# Altium project 280049 Tester Board.PrjPcb
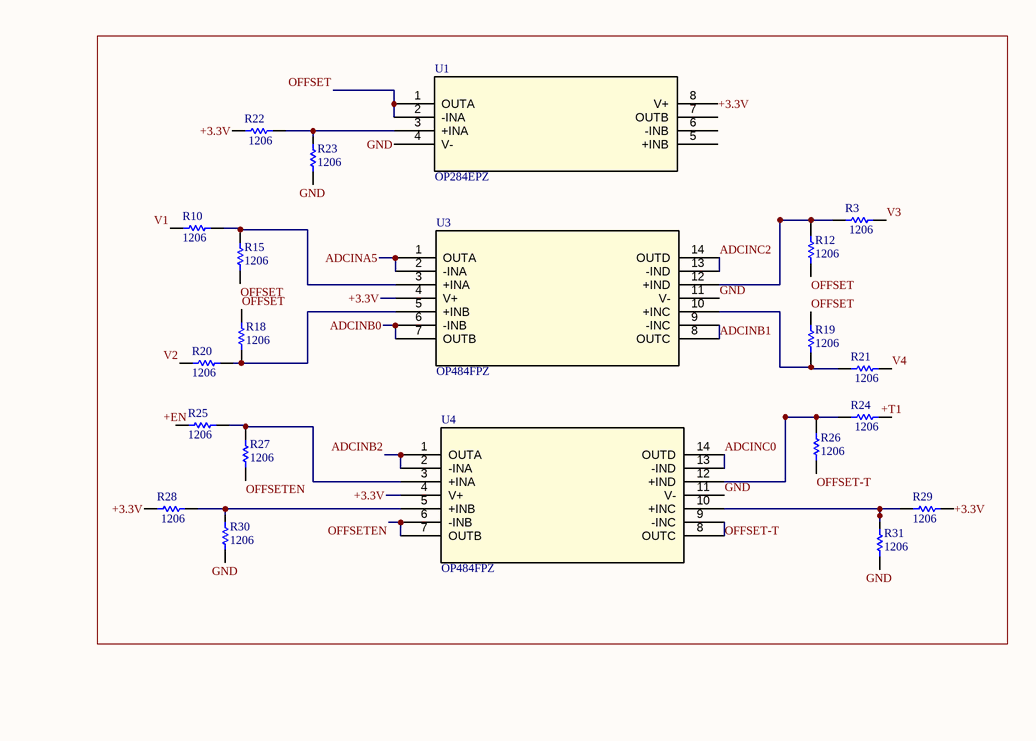
[diagram p0: 280049 tester board.SchDoc, top left]
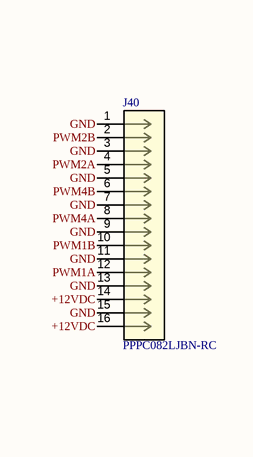
[diagram p1: 280049 tester board.SchDoc, top right]
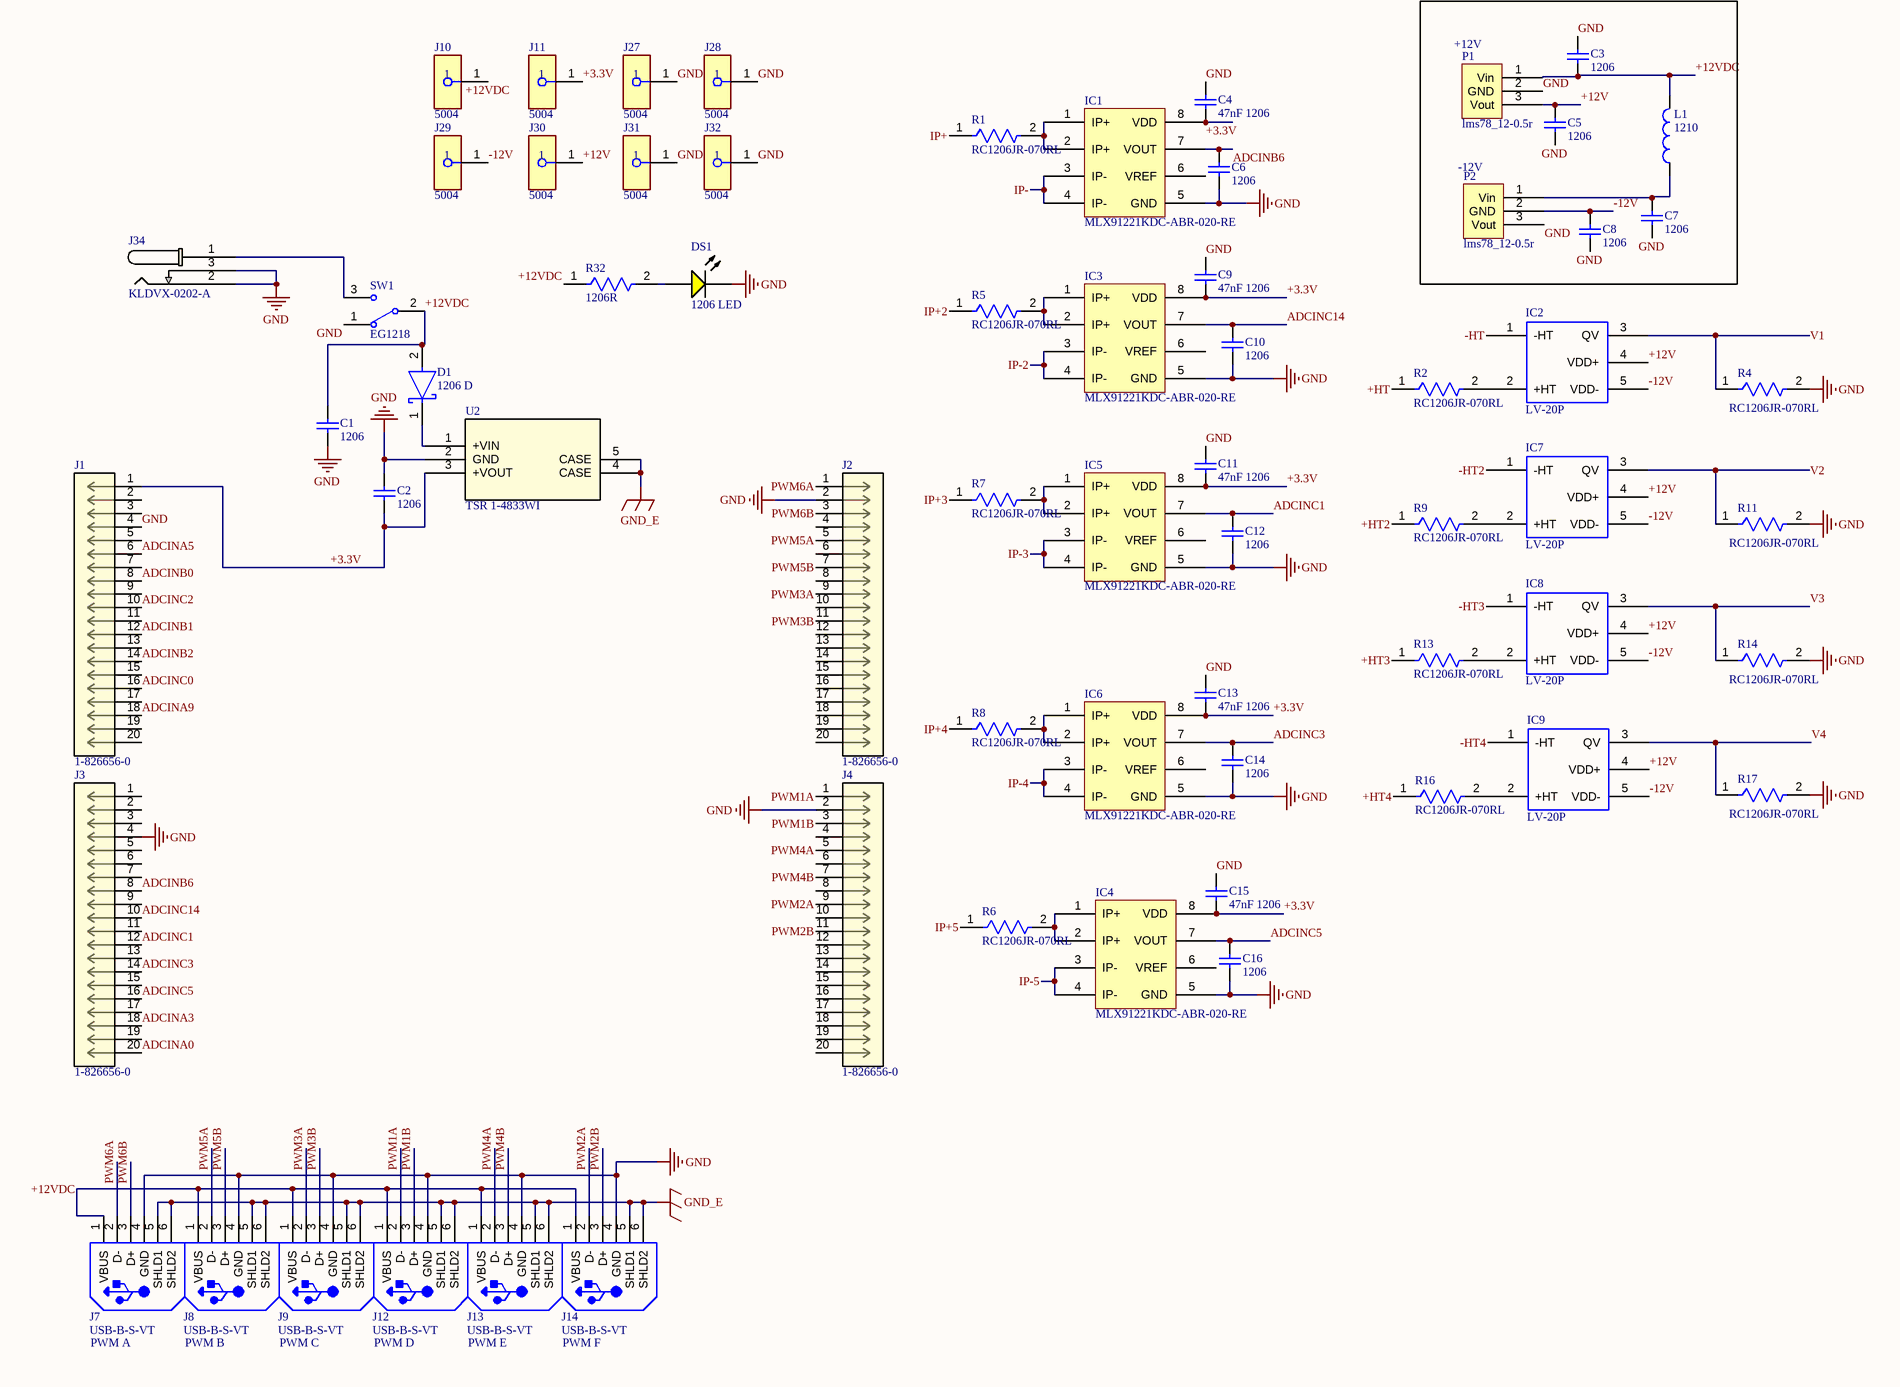
[diagram p2: 280049 tester board.SchDoc, bottom left]
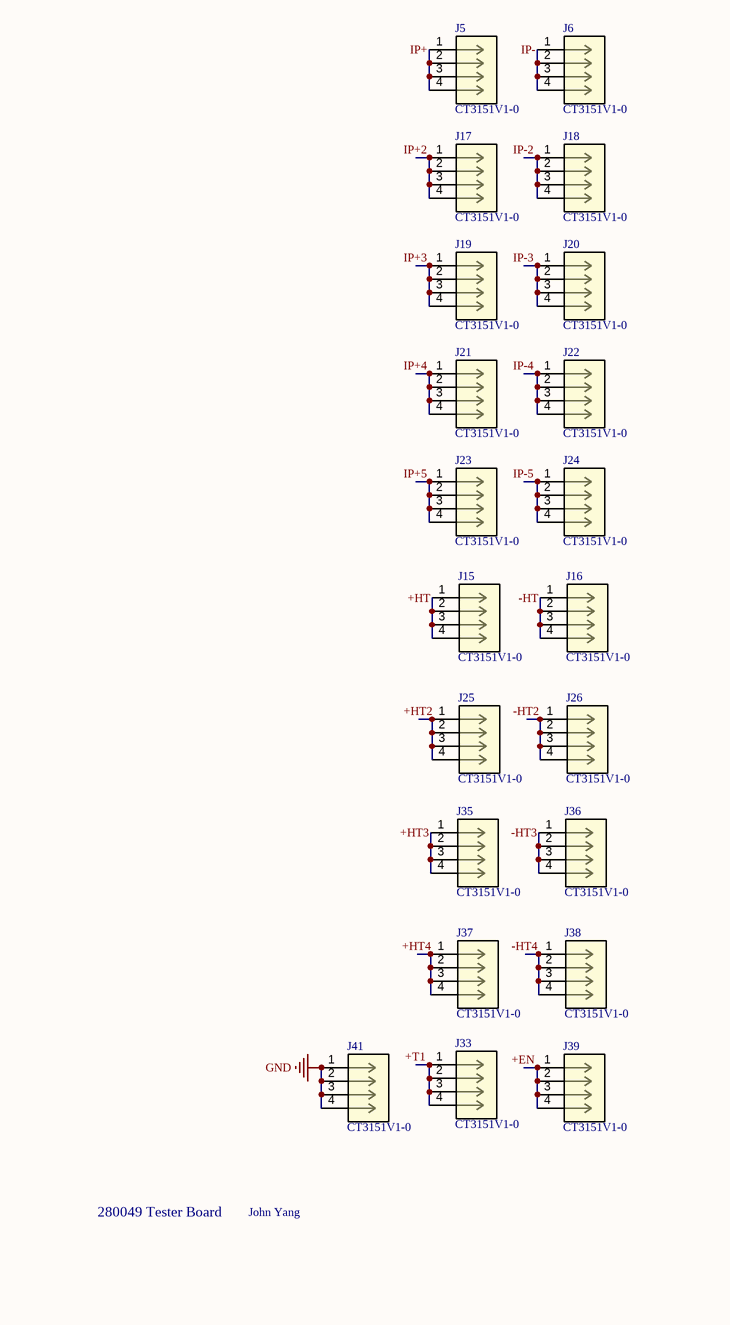
[diagram p3: 280049 tester board.SchDoc, bottom right]
1 sheet, 108 parts. Net scope: global (net labels, ports and power ports of the same name join across sheets).
Board file: 280049 tester board.PcbDoc

## Sheet 280049 tester board.SchDoc
size 558 x 431 mm; SheetNumber: 1; SheetTotal: 1

### Parts
C1  1206  [CAPC1206(3216)130_M]
C2  1206  [CAPC1206(3216)130_M]
C3  1206  [CAPC1206(3216)130_M]
C4  47nF 1206  [CAPC1206(3216)130_M]
C5  1206  [CAPC1206(3216)130_M]
C6  1206  [CAPC1206(3216)130_M]
C7  1206  [CAPC1206(3216)130_M]
C8  1206  [CAPC1206(3216)130_M]
C9  47nF 1206  [CAPC1206(3216)130_M]
C10  1206  [CAPC1206(3216)130_M]
C11  47nF 1206  [CAPC1206(3216)130_M]
C12  1206  [CAPC1206(3216)130_M]
C13  47nF 1206  [CAPC1206(3216)130_M]
C14  1206  [CAPC1206(3216)130_M]
C15  47nF 1206  [CAPC1206(3216)130_M]
C16  1206  [CAPC1206(3216)130_M]
D1  1206 D  [FP-SD1206S-MFG]
DS1  1206 LED  [LUMX-SML-LX1206YC-TR_V]
IC1  MLX91221KDC-ABR-020-RE  [MLX91221KDC-ABR-020-RE]
IC2  LV-20P  [LV-20P]
IC3  MLX91221KDC-ABR-020-RE  [MLX91221KDC-ABR-020-RE]
IC4  MLX91221KDC-ABR-020-RE  [MLX91221KDC-ABR-020-RE]
IC5  MLX91221KDC-ABR-020-RE  [MLX91221KDC-ABR-020-RE]
IC6  MLX91221KDC-ABR-020-RE  [MLX91221KDC-ABR-020-RE]
IC7  LV-20P  [LV-20P]
IC8  LV-20P  [LV-20P]
IC9  LV-20P  [LV-20P]
J1  1-826656-0  [CON20_2X10_P100UM_HDR_TYC]
J2  1-826656-0  [CON20_2X10_P100UM_HDR_TYC]
J3  1-826656-0  [CON20_2X10_P100UM_HDR_TYC]
J4  1-826656-0  [CON20_2X10_P100UM_HDR_TYC]
J5  CT3151V1-0  [CON4_CT3151V1-0_CTE]
J6  CT3151V1-0  [CON4_CT3151V1-0_CTE]
J7  PWM A  Supplier Part Number 1: USB-B-S-VT  [CONN4_5787834-1_TEC]
J8  PWM B  Supplier Part Number 1: USB-B-S-VT  [CONN4_5787834-1_TEC]
J9  PWM C  Supplier Part Number 1: USB-B-S-VT  [CONN4_5787834-1_TEC]
J10  5004  [FP-5004-MFG]
J11  5004  [FP-5004-MFG]
J12  PWM D  Supplier Part Number 1: USB-B-S-VT  [CONN4_5787834-1_TEC]
J13  PWM E  Supplier Part Number 1: USB-B-S-VT  [CONN4_5787834-1_TEC]
J14  PWM F  Supplier Part Number 1: USB-B-S-VT  [CONN4_5787834-1_TEC]
J15  CT3151V1-0  [CON4_CT3151V1-0_CTE]
J16  CT3151V1-0  [CON4_CT3151V1-0_CTE]
J17  CT3151V1-0  [CON4_CT3151V1-0_CTE]
J18  CT3151V1-0  [CON4_CT3151V1-0_CTE]
J19  CT3151V1-0  [CON4_CT3151V1-0_CTE]
J20  CT3151V1-0  [CON4_CT3151V1-0_CTE]
J21  CT3151V1-0  [CON4_CT3151V1-0_CTE]
J22  CT3151V1-0  [CON4_CT3151V1-0_CTE]
J23  CT3151V1-0  [CON4_CT3151V1-0_CTE]
J24  CT3151V1-0  [CON4_CT3151V1-0_CTE]
J25  CT3151V1-0  [CON4_CT3151V1-0_CTE]
J26  CT3151V1-0  [CON4_CT3151V1-0_CTE]
J27  5004  [FP-5004-MFG]
J28  5004  [FP-5004-MFG]
J29  5004  [FP-5004-MFG]
J30  5004  [FP-5004-MFG]
J31  5004  [FP-5004-MFG]
J32  5004  [FP-5004-MFG]
J33  CT3151V1-0  [CON4_CT3151V1-0_CTE]
J34  KLDVX-0202-A  [JACK_KLDVX-0202_KYC]
J35  CT3151V1-0  [CON4_CT3151V1-0_CTE]
J36  CT3151V1-0  [CON4_CT3151V1-0_CTE]
J37  CT3151V1-0  [CON4_CT3151V1-0_CTE]
J38  CT3151V1-0  [CON4_CT3151V1-0_CTE]
J39  CT3151V1-0  [CON4_CT3151V1-0_CTE]
J40  PPPC082LJBN-RC  [CONN_PPPC082LJBN-RC_SUL]
J41  CT3151V1-0  [CON4_CT3151V1-0_CTE]
L1  1210  [TDK-NLV32-PF_V]
P1  lms78_12-0.5r  [lms78_12-0.5r]
P2  lms78_12-0.5r  [lms78_12-0.5r]
R1  RC1206JR-070RL  [FP-RC1206-MFG]
R2  RC1206JR-070RL  [FP-RC1206-MFG]
R3  1206  [RESC3216X70X50NL05T20]
R4  RC1206JR-070RL  [FP-RC1206-MFG]
R5  RC1206JR-070RL  [FP-RC1206-MFG]
R6  RC1206JR-070RL  [FP-RC1206-MFG]
R7  RC1206JR-070RL  [FP-RC1206-MFG]
R8  RC1206JR-070RL  [FP-RC1206-MFG]
R9  RC1206JR-070RL  [FP-RC1206-MFG]
R10  1206  [RESC3216X70X50NL05T20]
R11  RC1206JR-070RL  [FP-RC1206-MFG]
R12  1206  [RESC3216X70X50NL05T20]
R13  RC1206JR-070RL  [FP-RC1206-MFG]
R14  RC1206JR-070RL  [FP-RC1206-MFG]
R15  1206  [RESC3216X70X50NL05T20]
R16  RC1206JR-070RL  [FP-RC1206-MFG]
R17  RC1206JR-070RL  [FP-RC1206-MFG]
R18  1206  [RESC3216X70X50NL05T20]
R19  1206  [RESC3216X70X50NL05T20]
R20  1206  [RESC3216X70X50NL05T20]
R21  1206  [RESC3216X70X50NL05T20]
R22  1206  [RESC3216X70X50NL05T20]
R23  1206  [RESC3216X70X50NL05T20]
R24  1206  [RESC3216X70X50NL05T20]
R25  1206  [RESC3216X70X50NL05T20]
R26  1206  [RESC3216X70X50NL05T20]
R27  1206  [RESC3216X70X50NL05T20]
R28  1206  [RESC3216X70X50NL05T20]
R29  1206  [RESC3216X70X50NL05T20]
R30  1206  [RESC3216X70X50NL05T20]
R31  1206  [RESC3216X70X50NL05T20]
R32  1206R  [FP-RC1206-MFG]
SW1  EG1218  [ESWI-EG1218_V]
U1  OP284EPZ  [N_8_ADI]
U2  TSR 1-4833WI  [TSR1WI-SINGLE_TRP]
U3  OP484FPZ  [N_14_ADI]
U4  OP484FPZ  [N_14_ADI]

### Nets
GND: C1.2 C2.1 C3.1 C4.1 C5.2 C6.2 C7.2 C8.2 C9.1 C10.2 C11.1 C12.2 C13.1 C14.2 C15.1 C16.2 DS1.2(K) IC1.5(GND) IC3.5(GND) IC4.5(GND) IC5.5(GND) IC6.5(GND) J1.4 J2.2 J3.4 J4.2 J7.4(GND) J8.4(GND) J9.4(GND) J12.4(GND) J13.4(GND) J14.4(GND) J27.1 J28.1 J31.1 J32.1 J34.2 J34.3 J40.1 J40.3 J40.5 J40.7 J40.9 J40.11 J40.13 J40.15 J41.1 J41.2 J41.3 J41.4 P1.2(GND) P2.3(Vout) R4.2 R11.2 R14.2 R17.2 R23.1 R30.1 R31.1 SW1.1 U1.4(V-) U2.2(GND) U3.11(V-) U4.11(V-)
GND_E: J7.5(SHLD1) J7.6(SHLD2) J8.5(SHLD1) J8.6(SHLD2) J9.5(SHLD1) J9.6(SHLD2) J12.5(SHLD1) J12.6(SHLD2) J13.5(SHLD1) J13.6(SHLD2) J14.5(SHLD1) J14.6(SHLD2) U2.4(CASE) U2.5(CASE)
+3.3V: C2.2 C4.2 C9.2 C11.2 C13.2 C15.2 IC1.8(VDD) IC3.8(VDD) IC4.8(VDD) IC5.8(VDD) IC6.8(VDD) J1.1 J11.1 R22.1 R28.1 R29.1 U1.8(V+) U2.3(+VOUT) U3.4(V+) U4.4(V+)
+12V: C5.1 IC2.4(VDD+) IC7.4(VDD+) IC8.4(VDD+) IC9.4(VDD+) J30.1 P1.3(Vout)
+12VDC: C1.1 C3.2 D1.2(A) J7.1(VBUS) J8.1(VBUS) J9.1(VBUS) J10.1 J12.1(VBUS) J13.1(VBUS) J14.1(VBUS) J40.14 J40.16 L1.2 P1.1(Vin) R32.1 SW1.2(COM)
+EN: J39.1 J39.2 J39.3 J39.4 R25.1
+HT: J15.1 J15.2 J15.3 J15.4 R2.1
+HT2: J25.1 J25.2 J25.3 J25.4 R9.1
+HT3: J35.1 J35.2 J35.3 J35.4 R13.1
+HT4: J37.1 J37.2 J37.3 J37.4 R16.1
+T1: J33.1 J33.2 J33.3 J33.4 R24.2
-12V: C8.1 IC2.5(VDD-) IC7.5(VDD-) IC8.5(VDD-) IC9.5(VDD-) J29.1 P2.2(GND)
-HT: IC2.1(-HT) J16.1 J16.2 J16.3 J16.4
-HT2: IC7.1(-HT) J26.1 J26.2 J26.3 J26.4
-HT3: IC8.1(-HT) J36.1 J36.2 J36.3 J36.4
-HT4: IC9.1(-HT) J38.1 J38.2 J38.3 J38.4
ADCINA0: J3.20
ADCINA3: J3.18
ADCINA5: J1.6 U3.1(OUTA) U3.2(-INA)
ADCINA9: J1.18
ADCINB0: J1.8 U3.6(-INB) U3.7(OUTB)
ADCINB1: J1.12 U3.8(OUTC) U3.9(-INC)
ADCINB2: J1.14 U4.1(OUTA) U4.2(-INA)
ADCINB6: C6.1 IC1.7(VOUT) J3.8
ADCINC0: J1.16 U4.13(-IND) U4.14(OUTD)
ADCINC1: C12.1 IC5.7(VOUT) J3.12
ADCINC2: J1.10 U3.13(-IND) U3.14(OUTD)
ADCINC3: C14.1 IC6.7(VOUT) J3.14
ADCINC5: C16.1 IC4.7(VOUT) J3.16
ADCINC14: C10.1 IC3.7(VOUT) J3.10
IP+: J5.1 J5.2 J5.3 J5.4 R1.1
IP+2: J17.1 J17.2 J17.3 J17.4 R5.1
IP+3: J19.1 J19.2 J19.3 J19.4 R7.1
IP+4: J21.1 J21.2 J21.3 J21.4 R8.1
IP+5: J23.1 J23.2 J23.3 J23.4 R6.1
IP-: IC1.3(IP-) IC1.4(IP-) J6.1 J6.2 J6.3 J6.4
IP-2: IC3.3(IP-) IC3.4(IP-) J18.1 J18.2 J18.3 J18.4
IP-3: IC5.3(IP-) IC5.4(IP-) J20.1 J20.2 J20.3 J20.4
IP-4: IC6.3(IP-) IC6.4(IP-) J22.1 J22.2 J22.3 J22.4
IP-5: IC4.3(IP-) IC4.4(IP-) J24.1 J24.2 J24.3 J24.4
OFFSET: R12.1 R15.1 R18.2 R19.2 U1.1(OUTA) U1.2(-INA)
OFFSET-T: R26.1 U4.8(OUTC) U4.9(-INC)
OFFSETEN: R27.1 U4.6(-INB) U4.7(OUTB)
PWM1A: J4.1 J12.2(D-) J40.12
PWM1B: J4.3 J12.3(D+) J40.10
PWM2A: J4.9 J14.2(D-) J40.4
PWM2B: J4.11 J14.3(D+) J40.2
PWM3A: J2.9 J9.2(D-)
PWM3B: J2.11 J9.3(D+)
PWM4A: J4.5 J13.2(D-) J40.8
PWM4B: J4.7 J13.3(D+) J40.6
PWM5A: J2.5 J8.2(D-)
PWM5B: J2.7 J8.3(D+)
PWM6A: J2.1 J7.2(D-)
PWM6B: J2.3 J7.3(D+)
V1: IC2.3(QV) R4.1 R10.1
V2: IC7.3(QV) R11.1 R20.1
V3: IC8.3(QV) R3.2 R14.1
V4: IC9.3(QV) R17.1 R21.2
NetC7_1: C7.1 L1.1 P2.1(Vin)
NetD1_1: D1.1(C) U2.1(+VIN)
NetDS1_1: DS1.1(A) R32.2
NetIC1_1: IC1.1(IP+) IC1.2(IP+) R1.2
NetIC2_2: IC2.2(+HT) R2.2
NetIC3_1: IC3.1(IP+) IC3.2(IP+) R5.2
NetIC4_1: IC4.1(IP+) IC4.2(IP+) R6.2
NetIC5_1: IC5.1(IP+) IC5.2(IP+) R7.2
NetIC6_1: IC6.1(IP+) IC6.2(IP+) R8.2
NetIC7_2: IC7.2(+HT) R9.2
NetIC8_2: IC8.2(+HT) R13.2
NetIC9_2: IC9.2(+HT) R16.2
NetJ34_1: J34.1 SW1.3
NetR3_1: R3.1 R12.2 U3.12(+IND)
NetR10_2: R10.2 R15.2 U3.3(+INA)
NetR18_1: R18.1 R20.2 U3.5(+INB)
NetR19_1: R19.1 R21.1 U3.10(+INC)
NetR22_2: R22.2 R23.2 U1.3(+INA)
NetR24_1: R24.1 R26.2 U4.12(+IND)
NetR25_2: R25.2 R27.2 U4.3(+INA)
NetR28_2: R28.2 R30.2 U4.5(+INB)
NetR29_2: R29.2 R31.2 U4.10(+INC)

Not connected (* = marked no-connect by the designer): IC1 6(VREF); IC3 6(VREF); IC4 6(VREF); IC5 6(VREF); IC6 6(VREF); J1 2 3 5 7 9 11 13 15 17 19 20; J2 4 6 8 10 12 13 14 15 16 17 18 19 20; J3 1 2 3 5 6 7 9 11 13 15 17 19; J4 4 6 8 10 12 13 14 15 16 17 18 19 20; U1 5(+INB) 6(-INB) 7(OUTB)

### Notes on the sheet
- (near P1) +12V
- (near P2) -12V
- 280049 Tester Board
- John Yang
- DWG. NO.
- REV.
- SHT.
- REVISION
- DESCRIPTION
- DATE
- APPROVED
- THIS DOCUMENT AND THE DATA DISCLOSED HEREIN OR HEREWITH IS THE PROPERTY OF ALTIUM LIMITED AND MAY BE FREELY DISTRIBUTED IN WHOLE. NO RIGHTS ARE RESERVED OR EXPRESS OR IMPLIED WARANTEE GIVEN.
- ENG:
- DSN:
- APPROVALS
- PROJECT
- DOCUMENT REVISION:
- DESIGN ITEM:
- CHK:
- BOM:
- REFERENCE DOCUMENTS
- PROJECT REVISION:
- TITLE
- FAB DWG:
- PCB DWG:
- ASSY DWG:
- SCALE:
- SIZE
- C
- CAGE CODE
- FILE NAME
- DWG NO.
- SHEET
- OF
- REV

### Library data of the parts
C1-C3 C5-C8 C10 C12 C14 C16 = CMP-1037-04007-1: CAP 47nF 200V ±10% 1206 (3216 Metric) Thickness 1.3mm SMD; Case-Metric: 3216; Tolerance: Â±10%; Technology: SMT; Max Thickness: 1.3 mm; Value: 47nF; Case-EIA: 1206; Rated Voltage: 200 V
C4 C9 C11 C13 C15 = CMP-1037-04007-1: CAP 47nF 200V ±10% 1206 (3216 Metric) Thickness 1.3mm SMD; Case-Metric: 3216; Tolerance: Â±10%; Case-EIA: 1206; Technology: SMT; Max Thickness: 1.3 mm; Value: 47nF; Rated Voltage: 200 V
D1 = CMP-04549-000002-1: DIODE SCHOTTKY 40V 2A 1206; Manufacturer Part Number: SD1206S040S2R0; Manufacturer: AVX; Value: 115pF; Max Surge Forward Current: 40A; Peak Reverse Current: 0.03mA; Temperature Range Low: -55°C; Digikey Description: DIODE SCHOTTKY 40V 2A 1206; Forward Current: 2A; Automotive: No; Mouser Description: Small Signal Schottky Diode, Single, 40 V, 2 A, 500 Mv, 40 A, 125 C Rohs Compliant: Yes; ComponentLink2Description: Datasheet; Lead Free: Yes; ComponentLink2URL: http://datasheets.avx.com/schottky.pdf; Package: SD1206S; Capacitance: 115pF; Octopart: https://octopart.com/sd1206s040s2r0-avx-24931771; Max Repetitive Reverse Voltage: 40V; Height: 1.16mm; Device Class L2: Diodes; Category: Diode; Device Class L3: Schottky Diodes; Temperature Range High: +125°C; Device Class L1: Discrete Semiconductors; RoHS: TRUE; Temperature: -55°C to +125°C
DS1 = CMP-2000-07124-1: Yellow LED, Water Clear Len, 585 nm, 2.1 V, -40 to 85 degC, 2-Pin SMD, RoHS, Tape and Reel; Manufacturer: Lumex; Product Training Modules: LEDsBenefitsofCustomLEDandLCDTechnology; Millicandela Rating: 6mcd; Catalog Drawings: SML-LX1206SeriesTopSML-LX1206SeriesSideSML-LX1206SeriesBottomSML-LX1206SeriesFootprint; Wavelength - Peak: 585nm; Other Names: 67-1358-2LU60357TRSMLLX1206YCTR; Lens Style/Size: RectanglewithFlatTop; Current - Test: 20mA; Lens Color: Colorless; Viewing Angle: 160°; Voltage - Forward (Vf) (Typ): 2.1V; Online Catalog: SML-LX1206RectanglewithFlatTop1206PackageLEDs; Mounting Type: SurfaceMount; Package Description: 2-Pin Surface Mount Device, Body 3.2 x 1.5 mm; Datasheet Version: Rev. K, 08/2012; Features: -; Color: Yellow; RoHS Information: RoHSCertofCompliance; Package Reference: SML-LX1206YC-TR; Supplier Device Package: 1206; Standard Package: 3,000; Series: -; Wavelength - Dominant: -; Package / Case: 1206(3216Metric); Mounting Technology: SurfaceMount; Height (Max): 1.10mm; Lens Transparency: Clear; Datasheet URL: http://www.lumex.com/content/files/ProductAttachment/SML-LX1206YC-TR.pdf; Family: LEDIndication-Discrete; Manufacturer URL: http://www.lumexinstruments.com/; Packaging: Tape&Reel(TR); Category: Optoelectronics; Size / Dimension: 3.20mmLx1.60mmW
IC1 IC3-IC6 = CMP-031-00006-1: .088 W; Design Item ID: MLX91221KDC-ABR-020-RE; Source: MLX91221KDC-ABR-020-RE.SchLib
IC2 IC7-IC9 = LV-20P: 0.15 W
J1-J4 = CMP-012-000003-1: No Description Available; Mfr_Name: TE Connectivity; Source: 1-826656-0.SchLib; RefDes: RefDes; Design Item ID: 1-826656-0; Type: Type
J5 J6 J15-J26 J33 J35-J39 J41 = CMP-010-000001-1: No Description Available; Mfr_Name: CAL TEST ELECTRONICS; Manufacturer_Part_Number: CT3151V1-0; Type: DEV; RefDes: RefDes; Copyright: Copyright (C) 2024 Ultra Librarian. All rights reserved.; Design Item ID: CT3151V1-0; Source: CT3151V1-0.SchLib
J7-J9 J12-J14 = CONN_USB_TypeB: USB TYPE B SINGLE VERTICAL; Manufacturer: Adam Tech; Number of Terminals/Pins: 4; Plating: Bright,Tin; Gender: Receptacle; Number of Ports: 1; Current Rating: 1A; Circuit Application: Signal; Connector System: Cable-to-Board; Voltage Rating (AC): 30V; Insulation Resistance: 1GR; USB Standard: USB 2.0; Pitch: 2.5mm; Plating Thickness: 0.76um; Tail Length: 3.01mm; PCB Thickness: 1.57mm; RoHS: Yes; Category: Audio / Video Connectors; Stock 1: 1592; Pricing 1: 1=2.22000, 10=2.13000, 25=1.95280, 40=1.86400, 144=1.77521, 288=1.55333, 576=1.50894, 1008=1.33143 (USD); Mount: Through Hole,Vertical; Contact Plating: Gold; Contact Material: Copper Alloy,Copper; Housing Color: Black; Housing Material: Thermoplastic; Color: Black; Min Operating Temperature: -67°C; Max Operating Temperature: 185°C; Termination: Through Hole; Orientation: Vertical; Packaging: Tray; Package Quantity: 144; Connector Type: Receptacle; Number of Contacts: 4; Number of Positions: 4; Contact Current Rating: 1A; Series: B; Length: 12.03mm; Depth: 11.46mm; Radiation Hardening: No; ELV: Compliant; RoHS Compliant: Yes; Flammability Rating: UL94 V-0; REACH SVHC: No SVHC; Lead Free: Lead Free; Stock 2: 965; Pricing 2: 1=0.80860, 10=0.70270, 25=0.63690, 40=0.59390, 100=0.56400, 300=0.51060, 500=0.50550, 1000=0.43830 (USD); Insulation Color: Black; Voltage Rating: 30V; Supplier 1: Arrow Electronics; ComponentLink9Description: New link; ComponentLink9URL: https://www.digikey.com/en/products/detail/adam-tech/USB-B-S-VT/9829305?s=N4IgTCBcDa4AwFYDsBaAqgZQEIpxlAagCooByAIiALoC%2BQA
J10 J11 J27-J32 = CMP-2000-05575-2: PC TEST POINT MINIATURE YELLOW; Manufacturer: Keystone; Number Of Contacts: 1; Is Female: yes; Device Class L1: Connectors; Manufacturer Part Number: 5004; Digikey Description: PC TEST POINT MINIATURE YELLOW; ComponentLink2URL: https://www.keyelco.com/product-pdf.cfm?p=1313; Lead Free: Yes; ComponentLink2Description: Datasheet; Category: Conn; Height: 4.72mm; Octopart: https://octopart.com/5004-keystone-28591; Mouser Description: TEST POINT PC MINI .040"D YELLOW; Device Class L3: unset; Contact Material: Silver; Package: 5004; Automotive: No; Device Class L2: unset; RoHS: TRUE
J34 = KLDVX-0202-A: No Description Available; Mfr_Name: KYCON, INC.; Type: Power Connectors; RefDes: RefDes
J40 = PPPC082LJBN-RC: No Description Available; Mfr_Name: Sullins; RefDes: RefDes; Type: Type
L1 = CMP-2000-06854-1: Wire Wound Inductor, 1 uH, +/- 5%, -40 to 105 degC, 2-Pin Molded, RoHS, Tape and Reel; Manufacturer: TDK; Frequency - Test: 7.96MHz; Product Training Modules: SMDInductors; Inductance: 1µH; Q @ Freq: 30@7.96MHz; Other Names: 445-1517-1; Current Rating: 400mA; Catalog Drawings: NLV32T,NLCV32TSeriesTop / NLV32T,NLCV32TSeriesSide / NLV32T,NLCV32TSeriesEnd; Shielding: Unshielded; Frequency - Self Resonant: 120MHz; Dynamic Catalog: NLVSeries; DC Resistance (DCR): 700mOhmMax; Category: Inductors,Coils,Chokes; Manufacturer URL: http://www.tdk.com/; Mounting Type: SurfaceMount; Package Description: 2-Pin Surface Mount Device, Body 3.2 x 2.5 mm; Size / Dimension: 0.126"Lx0.079"Wx0.086"H(3.20mmx2.50mmx2.20mm); Package / Case: 1210(3225Metric); Mounting Technology: SurfaceMount; Tolerance: ±5%; Operating Temperature: -40°C~105°C; Family: FixedInductors; Package Reference: NLV32-PF; Standard Package: 1; Datasheet Version: 09/2016; Packaging: CutTape(CT); Series: NLV; Datasheet URL: https://product.tdk.com/info/en/catalog/datasheets/inductor_commercial_standard_nlv32-pf_en.pdf
R1 R2 R4-R9 R11 R13 R14 R16 R17 = CMP-2100-03681-2: RES SMD 0 OHM JUMPER 1/4W 1206; Manufacturer: YAGEO; Voltage Rating: 200V; Temperature Coefficient: 300ppm/°C; Power Rating: 0.25W; Value: 0Ω; Tolerance: 5%; Manufacturer Part Number: RC1206JR-070RL; Temperature Range Low: -55°C; Category: Res; Automotive: No; Ipc Land Pattern Name: RESC310160X55; Device Class L1: Passive Components; Temperature: -55°C to +155°C; ComponentLink2URL: https://www.yageo.com/upload/media/product/productsearch/datasheet/rchip/PYu-RC_Group_51_RoHS_L_10.pdf; Lead Free: Yes; Height: 0.65mm; Footprint Url: https://www.yageo.com/upload/website/yageo_PYu-R_Mount_10_19050818_343.pdf; Package: RC1206; Digikey Description: RES SMD 0 OHM JUMPER 1/4W 1206; Temperature Range High: +155°C; Device Class L3: Chip SMD Resistors; Device Class L2: Resistors; Octopart: https://octopart.com/rc1206jr-070rl-yageo-40025601; Resistance: 0Ω; Series: RC; ComponentLink2Description: Datasheet; Composition: Thick Film; RoHS: TRUE; Mouser Description: Resistor: thick film; SMD; 1206; 0O; 0.25W; ±5%; -55÷155°C
R3 R10 R12 R15 R18-R31 = CMP-2003-00541-1: Manufacturer: Panasonic; Part Number: ERJ-8GEY0R00V
R32 = CMP-2100-03681-2: RES SMD 0 OHM JUMPER 1/4W 1206; Manufacturer Part Number: RC1206JR-070RL; Manufacturer: YAGEO; Voltage Rating: 200V; Temperature Coefficient: 300ppm/°C; Power Rating: 0.25W; Value: 0Ω; Tolerance: 5%; Temperature Range Low: -55°C; Category: Res; Automotive: No; Ipc Land Pattern Name: RESC310160X55; Device Class L1: Passive Components; Temperature: -55°C to +155°C; ComponentLink2URL: https://www.yageo.com/upload/media/product/productsearch/datasheet/rchip/PYu-RC_Group_51_RoHS_L_10.pdf; Lead Free: Yes; Height: 0.65mm; Footprint Url: https://www.yageo.com/upload/website/yageo_PYu-R_Mount_10_19050818_343.pdf; Package: RC1206; Digikey Description: RES SMD 0 OHM JUMPER 1/4W 1206; Temperature Range High: +155°C; Device Class L3: Chip SMD Resistors; Device Class L2: Resistors; Octopart: https://octopart.com/rc1206jr-070rl-yageo-40025601; Resistance: 0Ω; Series: RC; ComponentLink2Description: Datasheet; Composition: Thick Film; RoHS: TRUE; Mouser Description: Resistor: thick film; SMD; 1206; 0O; 0.25W; ±5%; -55÷155°C
SW1 = CMP-1696-00002-1: Slide Switch, 500 V, -20 to 70 degC, 3-Pin THD, RoHS; Case\Package: SOT-23-5; Output Current: 150 mA; Nominal Output Voltage: 3.3 V; Max Power Dissipation: 250 mW; Min Input Voltage: 4.3 V; Outputs: 1; Max Input Voltage: 8 V; Dropout Voltage: 300 mV; PackageDescription: 3-Pin Through Hole Device, Body 11.6 x 4 mm, Pitch 2.5 mm; ComponentLink1URL: http://www.e-switch.ch/en/; RoHSCompliant: true; Length: 3 mm; ComponentLink1Description: Manufacturer URL; Power Rating: 250 mW; Mount: Surface Mount; Max Operating Temperature: 85 degC; REACH SVHC: No SVHC; Radiation Hardening: No; Height: 1.3 mm; Pins: 5; Max Ouput Current: 150 mA; Output Voltage: 3.3 V; Width: 1.8 mm; Package Quantity: 3000; ComponentLink2URL: https://www.e-switch.com/system/asset/product_line/data_sheet/119/EG.pdf; Min Operating Temperature: -40 degC; ComponentLink2Description: Datasheet; DatasheetVersion: Oct-15; PackageReference: EG1218; Packaging: Tape and Reel
U1 = OP284EPZ: No Description Available; Mfr_Name: Analog Devices Inc; RefDes: RefDes; Type: Type
U2 = CMP-01539-104759532-1: TSR 1-4833WI DC-DC Converter, POL, Industrial, Encapsulated, 1A, 3.3V Out, 9-72V In; Output Power: 3.3W; NexarPartId: 104759532
U3 U4 = OP484FPZ: No Description Available; Mfr_Name: Analog Devices Inc; RefDes: RefDes; Type: Type